# EAGLE design fc power board v2 (EAGLE 7.4.0)
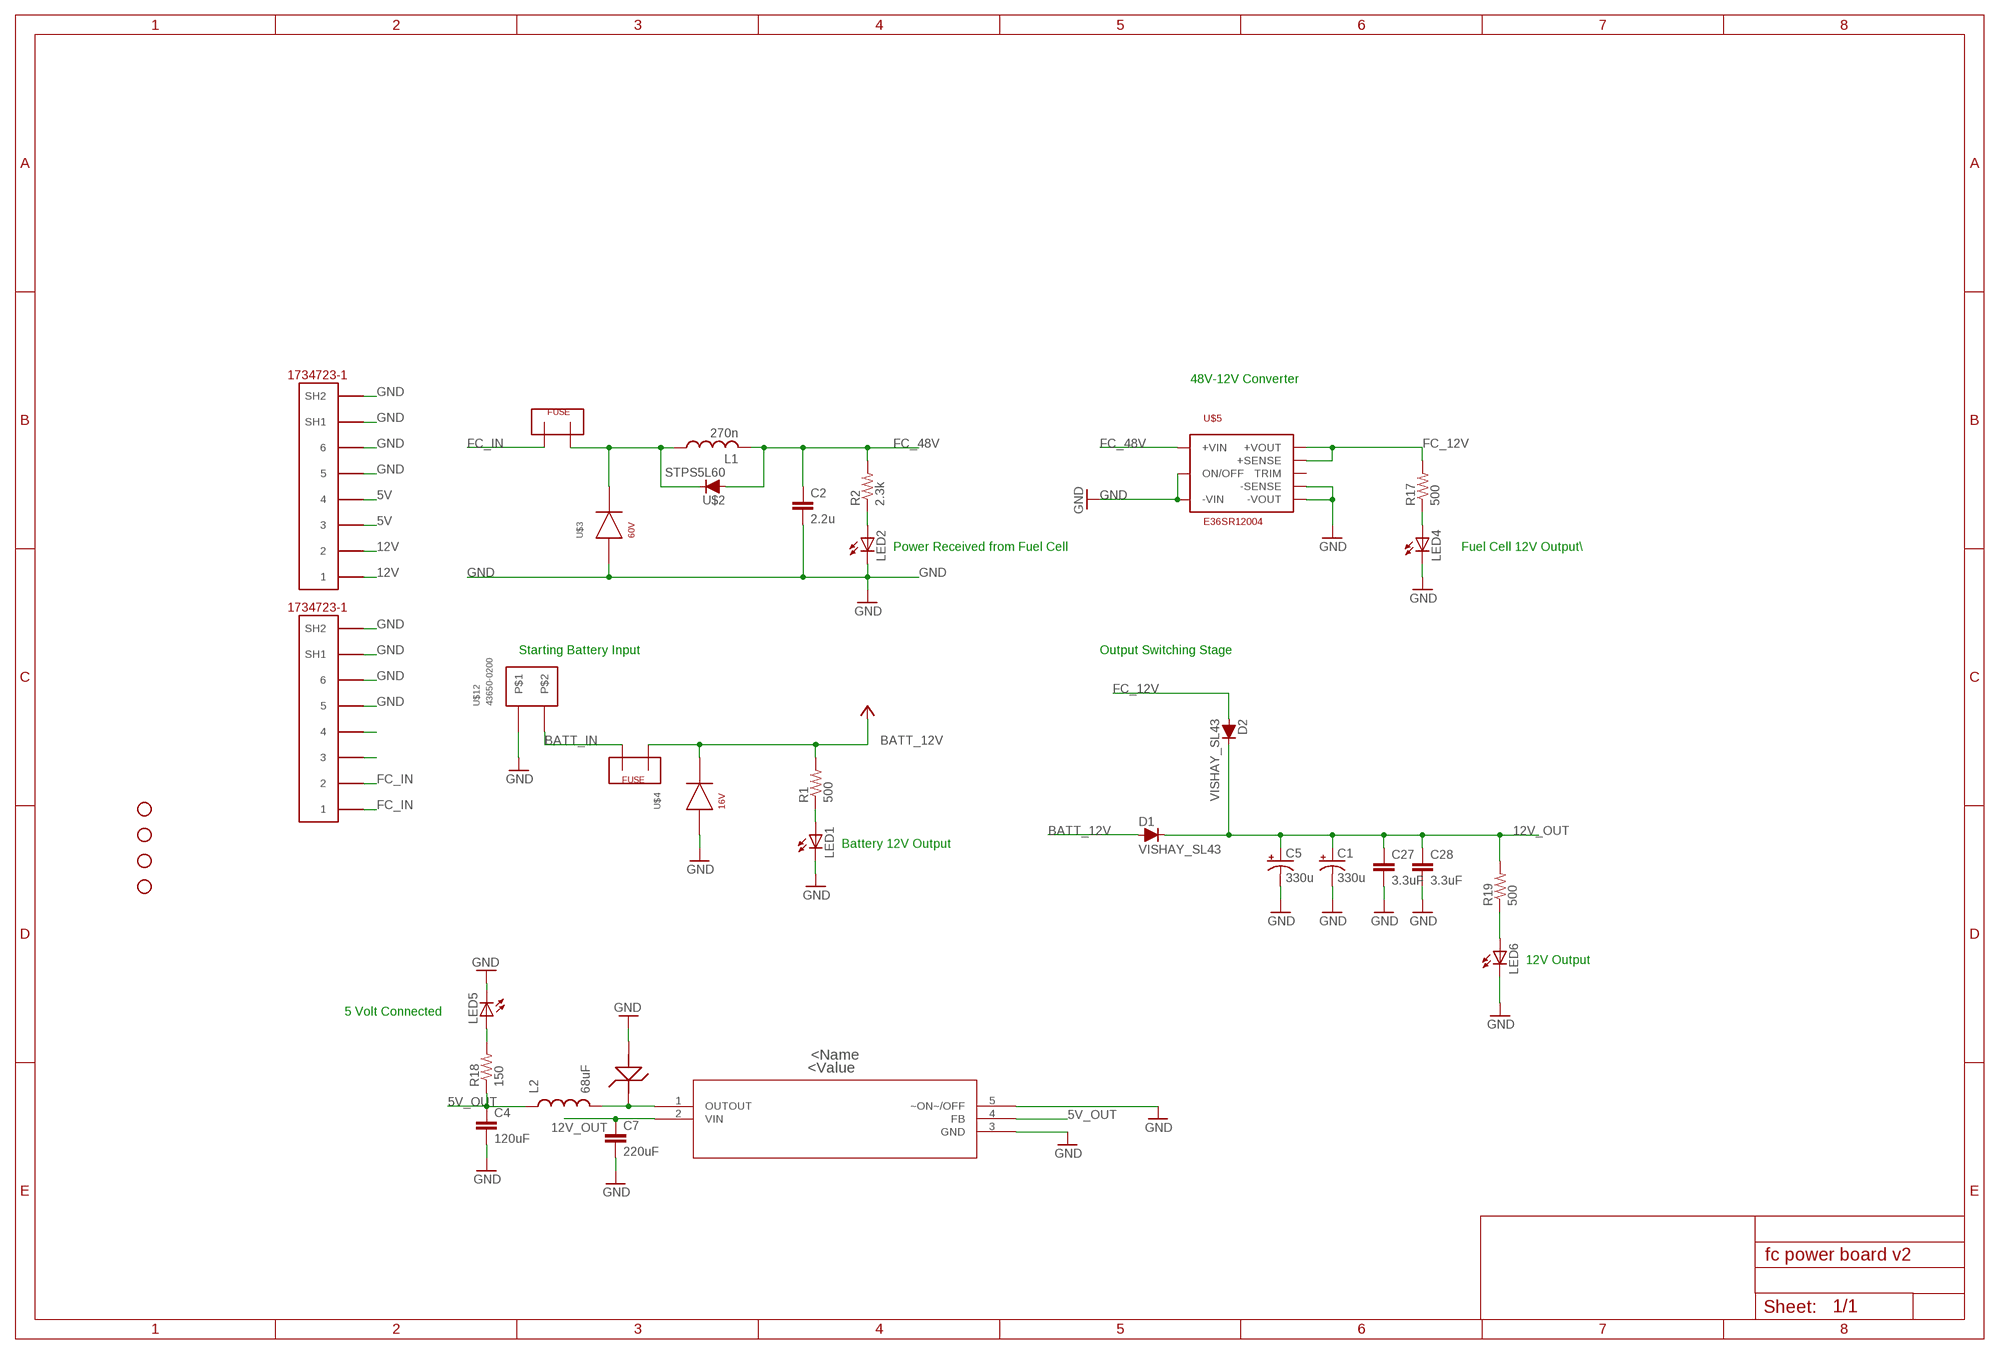
[diagram p0: schematic, sheet 1]

## Parts
C1  330u  CAP_POLE  [PANASONIC_E]
C2  2.2u  C-EUC1210  [C1210]
C4  120uF  CAP0805  [0805]
C5  330u  CAP_POLE  [PANASONIC_E]
C7  220uF  CAP0805  [0805]
C27  3.3uF  C-EUC0805K  [C0805K]
C28  3.3uF  C-EUC0805K  [C0805K]
D1  VISHAY_SL43  [DO-214AB_SMC]
D2  VISHAY_SL43  [DO-214AB_SMC]
L1  270n  L-USL3225P  [L3225P]
L2  68uF  INDUCTOR0805  [0805]
LED1  LED1206  [LED-1206]
LED2  LED1206  [LED-1206]
LED4  LED1206  [LED-1206]
LED5  LED1206  [LED-1206]
LED6  LED1206  [LED-1206]
R1  500  R-US_M0805  [M0805]
R2  2.3k  R-US_M0805  [M0805]
R17  500  R-US_M0805  [M0805]
R18  150  R-US_M0805  [M0805]
R19  500  R-US_M0805  [M0805]
STANDOFF1  STAND-OFF  [STAND-OFF]
STANDOFF2  STAND-OFF  [STAND-OFF]
STANDOFF3  STAND-OFF  [STAND-OFF]
STANDOFF4  STAND-OFF  [STAND-OFF]
U$2  STPS5L60  [STM_SMC]
U$3  SMBJ60CA  [.277X.089]
U$4  SMAJ16CA  [.25X.07]
U$5  E36SR12004  [2.30X0.90X0.34]
U$6  5555140-6  [1734723-1_RJ11]
U$7  FUSEMINI-BLADE  [MINI-BLADE-FUSE]
U$8  LM2595T-5.0  [T05D]
U$9  MURS120T3G  [MURS120T3G]
U$10  FUSEMINI-BLADE  [MINI-BLADE-FUSE]
U$11  5555140-6  [1734723-1_RJ11]
U$12  43650-0200  [43650-0200]

## Nets
5V: U$11.3 U$11.4
5V_OUT: C4.1 L2.1 R18.1 U$8.4(FB)
12V: U$11.1 U$11.2
12V_OUT: C1.+ C5.+ C7.1 C27.1 C28.1 D1.C D2.C R19.2 U$8.2(VIN)
BATT_12V: D1.A R1.2 U$4.CATHODE U$10.OUT ; supply symbol labelled +5V
BATT_IN: U$10.IN U$12.P$1
FC_12V: D2.A R17.2 U$5.P$7(+SENSE) U$5.P$8(+VOUT)
FC_48V: C2.1 L1.2 R2.2 U$2.A U$5.P$1(+VIN)
FC_FUSED: L1.1 U$2.C U$3.CATHODE U$7.IN
FC_IN: U$6.1 U$6.2 U$7.OUT
GND: C1.- C2.2 C4.2 C5.- C7.2 C27.2 C28.2 LED1.C LED2.C LED4.C LED5.C LED6.C U$3.ANODE U$4.ANODE U$5.P$2(ON/OFF) U$5.P$3(-VIN) U$5.P$4(-VOUT) U$5.P$5(-SENSE) U$6.5 U$6.6 U$6.SH1 U$6.SH2 U$8.3(GND) U$8.5(~ON~/OFF) U$9.P$2(PIN1) U$11.5 U$11.6 U$11.SH1 U$11.SH2 U$12.P$2
N$3: LED1.A R1.1
N$4: LED2.A R2.1
N$16: L2.2 U$8.1(OUTOUT) U$9.P$1
N$17: LED5.A R18.2
N$20: U$6.4
N$21: LED4.A R17.1
N$23: U$6.3
N$24: LED6.A R19.1
Unconnected: U$5.P$6(TRIM)

## Notes on the sheet
- 48V-12V Converter
- Power Received from Fuel Cell | Fuel Cell 12V Output\
- Starting Battery Input | Output Switching Stage
- Battery 12V Output
- 12V Output
- 5 Volt Connected

## Library data of the parts
C1 C5 = SparkFun-Capacitors:CAP_POL: Capacitor Polarized These are standard SMD and PTH capacitors. Normally 10uF, 47uF, and 100uF in electrolytic and tantalum varieties. Always verify the external diameter of the through hole cap, it varies with capacity, voltage, and manufacturer. The EIA devices should be standard.
C2 C27 C28 = resistor:C-EU: CAPACITOR, European symbol
C4 C7 = SparkFun-Passives:CAP: Capacitor Standard 0603 ceramic capacitor, and 0.1" leaded capacitor.
D1 D2 = Power Board Components:VISHAY_SL43
L1 = resistor:L-US: INDUCTOR, American symbol
L2 = SparkFun-Passives:INDUCTOR: Inductors Basic Inductor/Choke - 0603 and 1206. Footprints are not proven and vary greatly between part numbers. INDUCTOR POWER 3.3UH 4.0A SMD 0.197" L x 0.197" W x 0.177" H (5.00mm x 5.00mm x 4.50mm)
LED1 LED2 LED4-LED6 = SparkFun:LED: LEDs Standard schematic elements and footprints for 5mm, 3mm, 1206, and 0603 sized LEDs. 5mm - Spark Fun Electronics SKU : COM-00529 (and others)
R1 R2 R17-R19 = rcl:R-US_: RESISTOR, American symbol
STANDOFF1-STANDOFF4 = SparkFun-Electromechanical:STAND-OFF: #4 Stand Off This is the mechanical footprint for a #4 phillips button head screw. Use the keepout ring to avoid running the screw head into surrounding components. SKU : PRT-00447
U$2 = Power Board Components:STPS5L60
U$3 = Power Board Components:SMBJ60CA
U$4 = Power Board Components:SMAJ16CA
U$5 = Power Board Components:E36SR12004
U$6 U$11 = 5555140-6 RJ11:5555140-6
U$7 U$10 = Shell2013:FUSE
U$8 = 5V Reg LM2595T-5.0:LM2595T-5.0; BASE_PN: LM259X; COMPTYPE: Switcher; COPYRIGHT: Copyright C 2015 Accelerated Designs. All rights reserved; MANUFACTURER_PART_NUMBER: LM2595T50; SYMBOL: NameLM2595T50; TYPE: LM2595T5.0; VENDOR: National Semiconductor; VERSION: 05022007
U$9 = MURS120T3G:MURS120T3G
U$12 = Shell2013:43650-0200

## Board
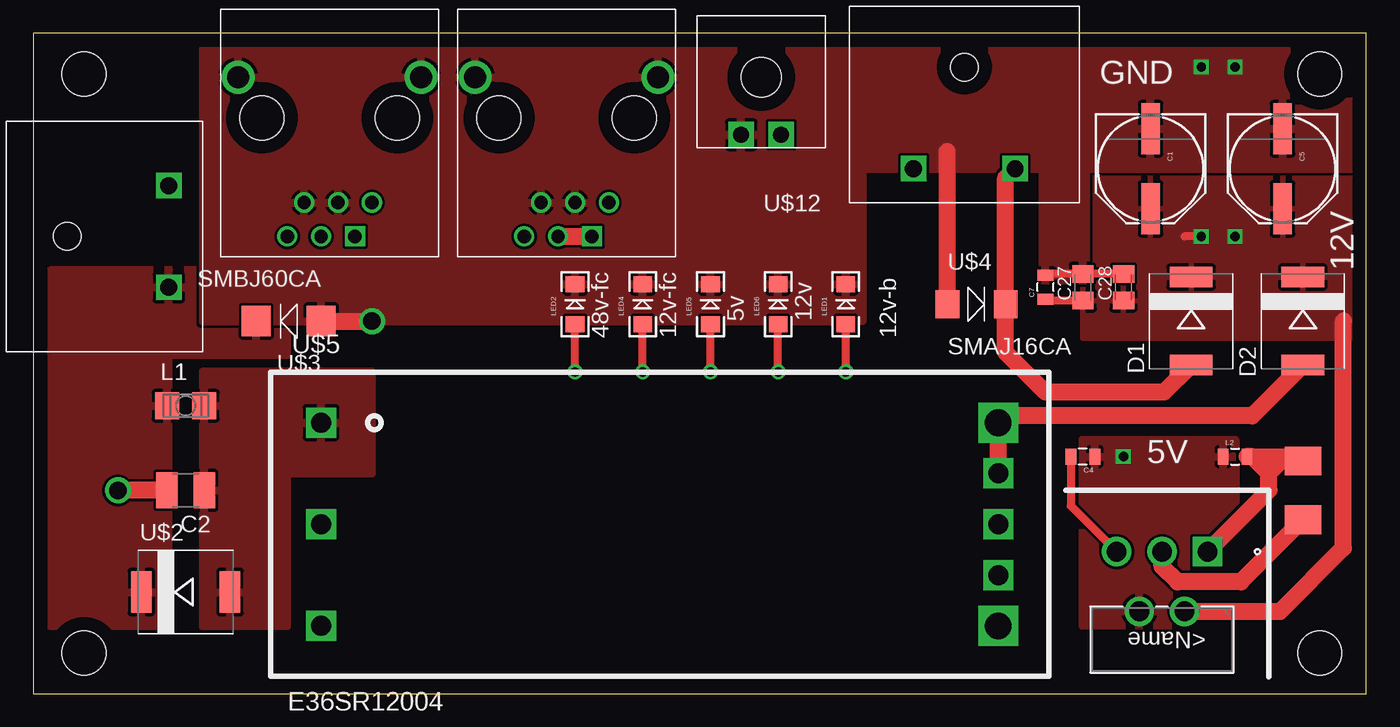
[diagram p1: board, top side]
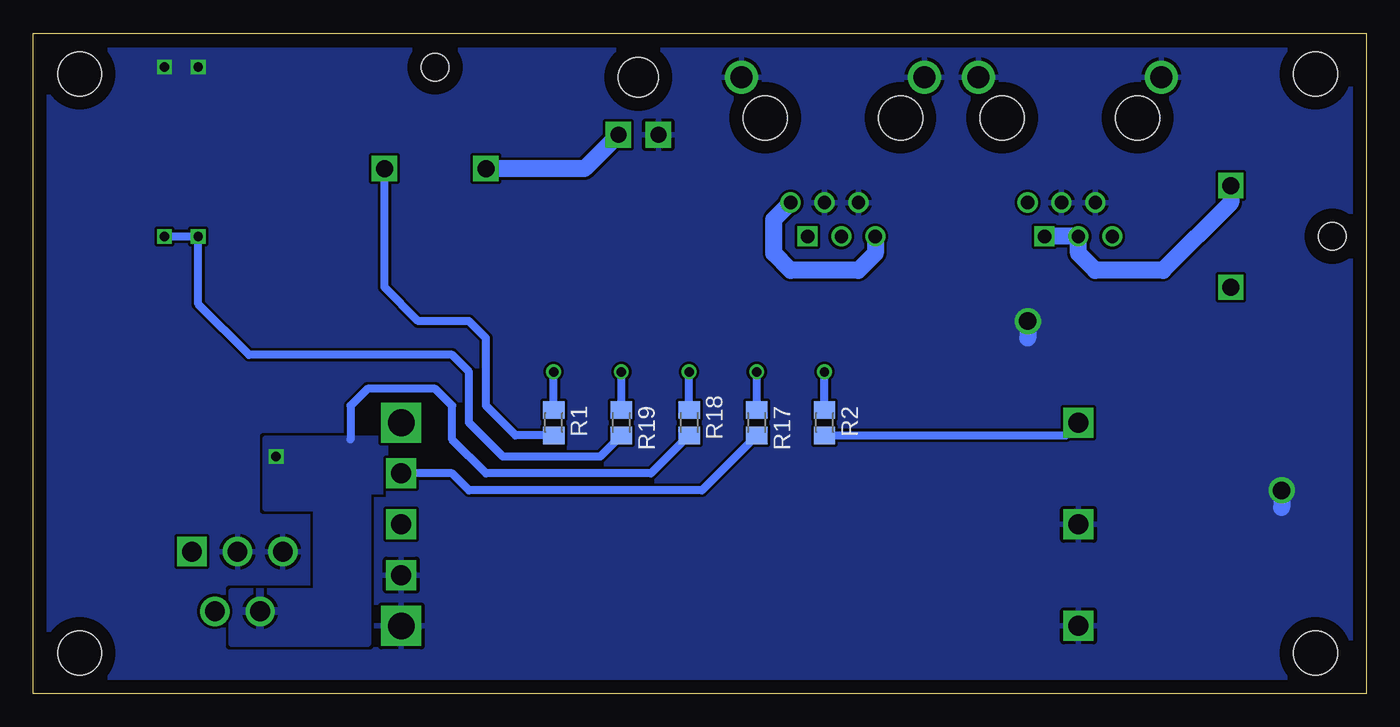
[diagram p2: board, bottom side, seen from below]

Size 100 x 49.52 mm. Coordinates in mm from the lower left corner, seen from the top.
Outline: 0,0 100,0 100,49.52 0,49.52 0,0
Copper layers (1*16): Top 0.035mm / dielectric 1.5mm / Bottom 0.035mm
Design rules "default": minimum track width 10mil, minimum drill 24mil, track to track 8mil, track to pad 8mil, pad to pad 8mil, via to via 8mil, smd to smd 8mil, copper to edge 40mil, drill to drill 8mil, minimum pad ring 10mil, minimum via ring 8mil, stop-mask expansion 4mil, vias tented up to drill 0mil, thermal gap 10mil

### Footprints (pad centres in the part's own frame; a part is rotated, then mirrored left to right if it is on the bottom)
PANASONIC_E = smd 3.8 x 1.4: + 3,0; - -3,0
C1210 = smd 1.6 x 2.7: 1 -1.4,0; 2 1.4,0
0805 = smd 0.8 x 1.2: 1 -0.9,0; 2 0.9,0
C0805K = smd 1.3 x 1.6: 1 -1,0; 2 1,0
DO-214AB_SMC = smd 1.524 x 3.2: A 3.302,0; C -3.302,0
L3225P = smd 1.8 x 2: 1 -1.4,0; 2 1.4,0
LED-1206 = smd 1.2 x 1.4: A -1.5,0; C 1.5,0
M0805 = smd 1.3 x 1.6: 1 -0.95,0; 2 0.95,0
STAND-OFF = hole 3.302: 0,0
STM_SMC = smd 1.54 x 3.14: A 3.325,0; C -3.325,0
.277X.089 = smd 2.159 x 2.261: ANODE 0,0; CATHODE 4.877,0
.25X.07 = smd 1.778 x 2.083: ANODE 0,0; CATHODE 4.369,0
2.30X0.90X0.34 = drill 1.5 square: P$1 -25.4,7.62; P$2 -25.4,0; P$3 -25.4,-7.62; P$5 25.4,-3.81; P$6 25.4,0; P$7 25.4,3.81 | drill 2 square: P$4 25.4,-7.62; P$8 25.4,7.62
1734723-1_RJ11 = drill 1 square: 1 -2.54,2.54 | drill 1: 2 0,2.54; 3 2.54,2.54; 4 -3.81,0; 5 -1.27,0; 6 1.27,0 | drill 1.65: SH1 -7.5,-9.4; SH2 6.22,-9.4 | hole 3.3: -5.72,-6.35; 4.44,-6.35
MINI-BLADE-FUSE = drill 1.27 square: IN 3.81,7.62; OUT -3.81,7.62 | hole 2.083: 0,0
T05D = drill 1.473 pad 1.981 square: 1 -6.807,-13.183 | drill 1.473 pad 1.981: 2 -5.105,-8.712; 3 -3.404,-13.183; 4 -1.702,-8.712; 5 0,-13.183
MURS120T3G = smd 2.159 x 2.743: P$1 -2.21,0; P$2 2.21,0
43650-0200 = drill 1.2 pad 1.93 square: P$1 -1.5,0; P$2 1.5,0 | hole 3: 0,-4.32

### Placement (x,y rotation side)
C1  83.82,39.37 270 top
C2  11.43,15.24 180 top
C4  78.74,17.78 180 top
C5  93.73,39.37 270 top
C7  75.95,30.48 90 top
C27  78.74,30.48 90 top
C28  81.79,30.48 90 top
D1  86.87,27.94 270 top
D2  95.25,27.94 270 top
L1  11.43,21.59 0 top
L2  90.17,17.78 0 top
LED1  60.96,29.21 90 top
LED2  40.64,29.21 90 top
LED4  45.72,29.21 90 top
LED5  50.8,29.21 90 top
LED6  55.88,29.21 90 top
R1  60.96,20.32 270 bottom
R2  40.64,20.32 270 bottom
R17  45.72,20.32 270 bottom
R18  50.8,20.32 90 bottom
R19  55.88,20.32 270 bottom
STANDOFF1  96.52,46.48 0 top
STANDOFF2  3.81,46.48 0 top
STANDOFF3  3.81,3.05 0 top
STANDOFF4  96.52,3.05 0 top
U$2  11.43,7.62 0 top
U$3  21.59,27.94 180 top
U$4  68.58,29.21 0 top
U$5  46.99,12.7 0 top
U$6  21.59,36.83 180 top
U$7  2.54,34.29 270 top
U$8  81.28,-2.54 180 top
U$9  95.25,15.24 270 top
U$10  69.85,46.99 180 top
U$11  39.37,36.83 180 top
U$12  54.61,41.91 180 top

### Tracks (layer width: path | path; a pad name or v marks a point on that pad's centre or on a via)
5V
  Bottom 1.27: U$11.3 36.83,33.02 38.1,31.75 43.18,31.75 44.45,33.02 44.45,35.56 U$11.4
5V_OUT  (via drill 0.7)
  Bottom 0.61: R18.1 53.66,16.51 66.04,16.51 68.58,19.05 68.58,21.59 69.85,22.86 74.93,22.86 76.2,21.59 76.2,19.05
  other vias: 81.79,17.78
  pour Top: 78.74,19.05 90.17,19.05 90.17,5.08 78.74,5.08
  pour Bottom: 73.66,19.05 82.55,19.05 82.55,13.97 78.74,13.97 78.74,7.62 85.09,7.62 85.09,3.81 74.93,3.81 74.93,15.24 73.66,15.24
12V
  Top 1.27: U$11.2 U$11.1
12V_OUT  (via drill 0.7)
  Top 0.61: C27.1 76.05,29.48 C7.1 | v87.63,34.29 86.36,34.29
  Top 1.27: U$8.2 93.55,6.17 98.3,10.92 98.3,27.94
  Bottom 0.61: v90.17,34.29 v87.63,34.29 87.63,29.21 83.82,25.4 68.58,25.4 67.31,24.13 67.31,20.32 64.77,17.78 57.47,17.78 R19.2
  pour Top (rank 2): 99.06,39.37 78.74,39.37 78.74,26.67 99.06,26.67
BATT_12V
  Top 1.27: D1.A 84.84,22.61 75.95,22.61 72.95,25.6 U$4.CATHODE 72.95,38.66 U$10.OUT
  Bottom 0.61: R1.2 63.82,19.37 66.04,21.59 66.04,26.67 67.31,27.94 71.12,27.94 73.66,30.48 U$10.OUT
BATT_IN
  Bottom 1.27: U$12.P$1 58.65,39.37 U$10.IN
FC_12V
  Top 1.27: U$5.P$7 U$5.P$8 72.9,20.83 91.44,20.83 D2.A
  Bottom 0.61: R17.2 49.85,15.24 67.31,15.24 68.58,16.51 U$5.P$7
FC_48V
  Bottom 0.61: R2.2 22.54,19.37 U$5.P$1
  pour Top: 25.4,24.13 12.7,24.13 12.7,5.08 19.05,5.08 19.05,16.51 25.4,16.51
FC_FUSED
  pour Top (rank 2): 19.05,31.75 1.27,31.75 1.27,5.08 10.16,5.08 10.16,25.4 19.05,25.4
FC_IN
  Bottom 1.27: U$7.OUT 10.16,36.83 15.24,31.75 20.32,31.75 21.59,33.02 U$6.2 U$6.1
GND  (via drill 0.7, 1.3)
  Top 0.61: C28.2 C27.2 76.05,31.48 C7.2 | C4.2 77.84,14.08 U$8.5
  Top 1.27: U$9.P$2 90.6,8.38 85.85,8.38 84.68,9.55 U$8.3 | C2.2 v6.35,15.24 | U$3.ANODE v25.4,27.94 | U$4.ANODE 68.58,40.64
  Bottom 1.27: v6.35,15.24 6.35,13.97 | v25.4,27.94 25.4,26.67
  other vias: 87.63,46.99 90.17,46.99
  pour Bottom (rank 2): 1.27,48.26 102.87,48.26 102.87,-2.54 -2.54,-2.54 -2.54,45.72
  pour Top: 99.06,48.26 12.7,48.26 12.7,27.94 62.23,27.94 62.23,39.37 75.69,39.37 75.69,30.99 78.99,30.99 78.99,39.37 99.06,39.37
N$3  (via drill 0.7)
  Top 0.61: v60.96,24.13 LED1.A
  Bottom 0.61: R1.1 v60.96,24.13
N$4  (via drill 0.7)
  Top 0.61: v40.64,24.13 LED2.A
  Bottom 0.61: R2.1 v40.64,24.13
N$16
  Top 1.27: U$8.1 92.71,15.27 92.71,16.51 | 92.71,16.51 91.44,17.78 | U$9.P$1 93.65,17.45 92.71,16.51 | 91.44,17.78 95.25,17.78 | 91.44,17.78 L2.2
N$17  (via drill 0.7)
  Top 0.61: v50.8,24.13 LED5.A
  Bottom 0.61: R18.2 v50.8,24.13
N$21  (via drill 0.7)
  Top 0.61: v45.72,24.13 LED4.A
  Bottom 0.61: R17.1 v45.72,24.13
N$24  (via drill 0.7)
  Top 0.61: v55.88,24.13 LED6.A
  Bottom 0.61: R19.1 v55.88,24.13

### Text on the board
tPlace: GND | 12V | 5v | 12v | 48v-fc | 12v-fc | 12v-b | 5V